# EAGLE design 4-layer (EAGLE 9.6.2)
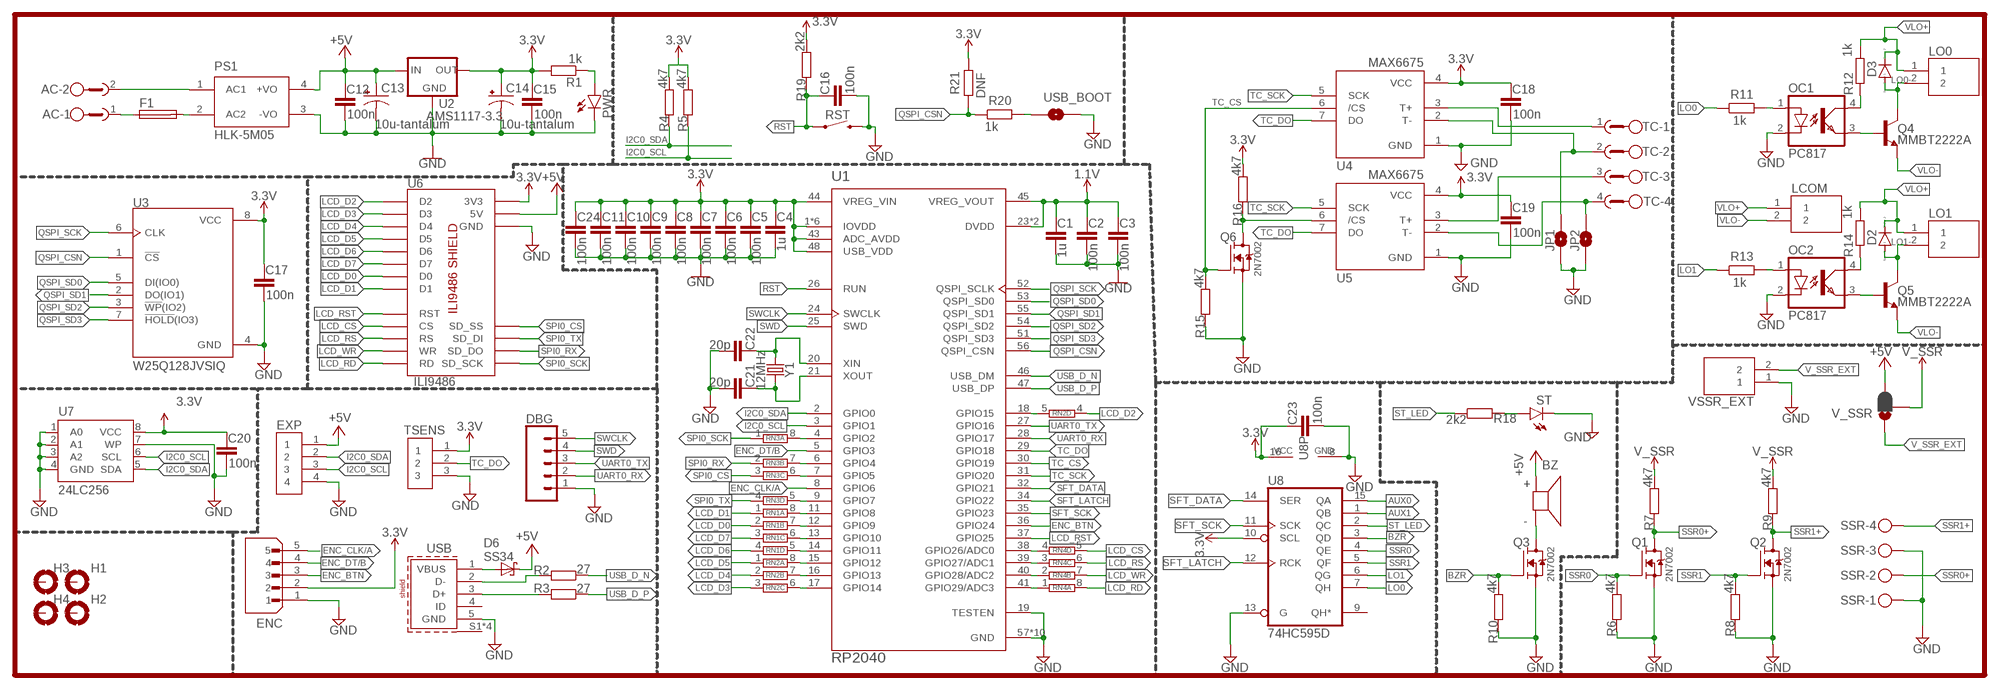
[diagram p0: schematic, sheet 1]

## Parts
AC  GMSTBA2  [GMSTBA2]
BZ  AI-1223-TWT-12V-R  [XDCR_AI-1223-TWT-12V-R]
C1  1u  C-EUC0603K  [C0603K]
C2  100n  C-EUC0603K  [C0603K]
C3  100n  C-EUC0603K  [C0603K]
C4  1u  C-EUC0603K  [C0603K]
C5  100n  C-EUC0603K  [C0603K]
C6  100n  C-EUC0603K  [C0603K]
C7  100n  C-EUC0603K  [C0603K]
C8  100n  C-EUC0603K  [C0603K]
C9  100n  C-EUC0603K  [C0603K]
C10  100n  C-EUC0603K  [C0603K]
C11  100n  C-EUC0603K  [C0603K]
C12  100n  C-EUC0603K  [C0603K]
C13  10u-tantalum  CPOL-USCT3528  [CT3528]
C14  10u-tantalum  CPOL-USCT3528  [CT3528]
C15  100n  C-EUC0603K  [C0603K]
C16  100n  C-EUC0603K  [C0603K]
C17  100n  C-EUC0603K  [C0603K]
C18  100n  C-EUC0603K  [C0603K]
C19  100n  C-EUC0603K  [C0603K]
C20  100n  C-EUC0603K  [C0603K]
C21  20p  C-EUC0603K  [C0603K]
C22  20p  C-EUC0603K  [C0603K]
C23  100n  C-EUC0603K  [C0603K]
C24  100n  C-EUC0603K  [C0603K]
D2  DIODE-DO-214AC  [DO-214AC]
D3  DIODE-DO-214AC  [DO-214AC]
D6  SS34  [DO214]
DBG  CONN_05NO_SILK  [1X05_NO_SILK]
ENC  B5B-XH-A(LF)(SN)  [JST_B5B-XH-A(LF)(SN)]
EXP  JST-XH-4P  B4B-XH-A(LF)(SN)  [JST_B4B-XH-A(LF)(SN)]
F1  FUSEBLANK_5X20MM  [FUSE_HOLDER_5X20MM]
H1  MOUNT-PAD-ROUND3.2  [3,2-PAD]
H2  MOUNT-PAD-ROUND3.2  [3,2-PAD]
H3  MOUNT-PAD-ROUND3.2  [3,2-PAD]
H4  MOUNT-PAD-ROUND3.2  [3,2-PAD]
JP1  JUMPER-SMT_2_NO_NO-SILK  [SMT-JUMPER_2_NO_NO-SILK]
JP2  JUMPER-SMT_2_NO_NO-SILK  [SMT-JUMPER_2_NO_NO-SILK]
LCOM  B2B-XH-A(LF)(SN)  [JST_B2B-XH-A(LF)(SN)]
LO0  B2B-XH-A(LF)(SN)  [JST_B2B-XH-A(LF)(SN)]
LO1  B2B-XH-A(LF)(SN)  [JST_B2B-XH-A(LF)(SN)]
OC1  PC817  [DIL04]
OC2  PC817  [DIL04]
PS1  HLK-5M05  [CONV_HLK-5M05]
PWR  LEDCHIP-LED0805  [CHIP-LED0805]
Q1  2N7002  [SOT95P240X111-3N]
Q2  2N7002  [SOT95P240X111-3N]
Q3  2N7002  [SOT95P240X111-3N]
Q4  MMBT2222A  TRANS_NPN-MMBT2222AL  [SOT23-3]
Q5  MMBT2222A  TRANS_NPN-MMBT2222AL  [SOT23-3]
Q6  2N7002  [SOT95P240X111-3N]
R1  1k  R-EU_R0603  [R0603]
R2  27  R-EU_R0603  [R0603]
R3  27  R-EU_R0603  [R0603]
R4  4k7  R-EU_R0603  [R0603]
R5  4k7  R-EU_R0603  [R0603]
R6  4k7  R-EU_R0603  [R0603]
R7  4k7  R-EU_R0603  [R0603]
R8  4k7  R-EU_R0603  [R0603]
R9  4k7  R-EU_R0603  [R0603]
R10  4k7  R-EU_R0603  [R0603]
R11  1k  R-EU_R0603  [R0603]
R12  1k  R-EU_R0603  [R0603]
R13  1k  R-EU_R0603  [R0603]
R14  1k  R-EU_R0603  [R0603]
R15  4k7  R-EU_R0603  [R0603]
R16  4k7  R-EU_R0603  [R0603]
R18  2k2  R-EU_R0603  [R0603]
R19  2k2  R-EU_R0603  [R0603]
R20  1k  R-EU_R0603  [R0603]
R21  DNF  R-EU_R0603  [R0603]
RN1  4R-N0402ARV341  [4X0402ARV341]
RN2  4R-N0402ARV341  [4X0402ARV341]
RN3  4R-N0402ARV341  [4X0402ARV341]
RN4  4R-N0402ARV341  [4X0402ARV341]
RST  MOMENTARY-SWITCH-SPST-SMD-6.0X3.5MM  [TACTILE_SWITCH_SMD_6.0X3.5MM]
SSR  MKDSN1,5/4-5,08  [MKDSN1,5/4-5,08]
ST  LEDCHIP-LED0805  [CHIP-LED0805]
TC  GMSTBA4  [GMSTBA4]
TSENS  B3B-XH-A(LF)(SN)  [JST_B3B-XH-A(LF)(SN)]
U1  RP2040  [QFN40P700X700X90-57N]
U2  AMS1117-3.3  AMS1117  [SOT89R]
U3  W25Q128JVSIQ  W25Q64BVSSIG  [SOIC127P790X216-8N]
U4  MAX6675  [SO08]
U5  MAX6675  [SO08]
U6  ILI9486  [ILI9486-SHIELD]
U7  24LC256  EEPROM-I2C256K  [SO08]
U8  74HC595D  [SO16]
USB  629105136821  [629105136821]
USB_BOOT  JUMPER-SMT_2_NO_SILK  [SMT-JUMPER_2_NO_SILK]
V_SSR  JUMPER-SMT_3_1-NC_PASTE_SILK  [SMT-JUMPER_3_1-NC_PASTE_SILK]
VSSR_EXT  B2B-XH-A(LF)(SN)  [JST_B2B-XH-A(LF)(SN)]
Y1  12MHz  CRYSTALPTH-HC49US  [HC49US]

## Nets
1.1V: C1.1 C2.1 C3.1 U1.23(DVDD) U1.45(VREG_VOUT) U1.50(DVDD)
3.3V: C4.1 C5.1 C6.1 C7.1 C8.1 C9.1 C10.1 C11.1 C14.+ C15.1 C17.1 C18.1 C19.1 C20.1 C23.1 C24.1 ENC.2 R1.2 R4.1 R5.1 R16.1 R19.1 R21.2 TSENS.1 U1.1(IOVDD) U1.10(IOVDD) U1.22(IOVDD) U1.33(IOVDD) U1.42(IOVDD) U1.43(ADC_AVDD) U1.44(VREG_VIN) U1.48(USB_VDD) U1.49(IOVDD) U2.3(OUT) U2.4(OUT) U3.8(VCC) U4.4(VCC) U5.4(VCC) U6.3V3 U7.8(VCC) U8.10(SCL) U8.16(VCC)
+5V: BZ.P(+) C12.1 C13.+ D6.C EXP.1 PS1.4(+VO) U2.1(IN) U6.5V V_SSR.3
AUX0: U8.15(QA)
AUX1: U8.1(QB)
BZR: Q3.1(G) R10.1 U8.3(QD)
ENC_BTN: ENC.3 U1.36(GPIO24)
ENC_CLK/A: ENC.5 U1.8(GPIO6)
ENC_DT/B: ENC.4 U1.5(GPIO3)
GND: C1.2 C2.2 C3.2 C4.2 C5.2 C6.2 C7.2 C8.2 C9.2 C10.2 C11.2 C12.2 C13.- C14.- C15.2 C16.2 C17.2 C18.2 C19.2 C20.2 C21.2 C22.2 C23.2 C24.2 DBG.1 ENC.1 EXP.4 JP1.1 JP2.1 OC1.2(C) OC2.2(C) PS1.3(-VO) PWR.C Q1.2(S) Q2.2(S) Q3.2(S) Q6.2(S) R6.2 R8.2 R10.2 R15.2 RST.2 SSR.1 SSR.3 ST.C TSENS.3 U1.19(TESTEN) U1.57(GND) U1.P$1(GND) U1.P$2(GND) U1.P$3(GND) U1.P$4(GND) U1.P$5(GND) U1.P$6(GND) U1.P$7(GND) U1.P$8(GND) U1.P$9(GND) U2.2(GND) U3.4(GND) U4.1(GND) U5.1(GND) U6.GND U6.GND1(GND) U6.GND2(GND) U7.1(A0) U7.2(A1) U7.3(A2) U7.4(GND) U7.7(WP) U8.8(GND) U8.13(G) USB.5(GND) USB_BOOT.2 VSSR_EXT.1
I2C0_SCL: EXP.3 R5.2 U1.3(GPIO1) U7.6(SCL)
I2C0_SDA: EXP.2 R4.2 U1.2(GPIO0) U7.5(SDA)
LCD_CS: RN4.5 U6.LCD_CS(CS)
LCD_D0: RN1.2 U6.LCD_D0(D0)
LCD_D1: RN1.1 U6.LCD_D1(D1)
LCD_D2: RN2.4 U6.LCD_D2(D2)
LCD_D3: RN2.3 U6.LCD_D3(D3)
LCD_D4: RN2.2 U6.LCD_D4(D4)
LCD_D5: RN2.1 U6.LCD_D5(D5)
LCD_D6: RN1.4 U6.LCD_D6(D6)
LCD_D7: RN1.3 U6.LCD_D7(D7)
LCD_RD: RN4.8 U6.LCD_RD(RD)
LCD_RS: RN4.6 U6.LCD_RS(RS)
LCD_RST: U1.37(GPIO25) U6.LCD_RST(RST)
LCD_WR: RN4.7 U6.LCD_WR(WR)
LO0: R11.1 U8.7(QH)
LO0-: D3.A LO0.2 Q4.3(C)
LO1: R13.1 U8.6(QG)
LO1-: D2.A LO1.2 Q5.3(C)
N$1: AC.1 F1.1
N$2: F1.2 PS1.2(AC2)
N$3: AC.2 PS1.1(AC1)
N$4: PWR.A R1.1
N$5: BZ.N(-) Q3.3(D)
N$6: R3.2 USB.3(D+)
N$7: R2.2 USB.2(D-)
N$8: OC1.1(A) R11.2
N$9: OC1.4(COL) R12.2
N$10: OC1.3(EMIT) Q4.1(B)
N$11: OC2.1(A) R13.2
N$12: OC2.4(COL) R14.2
N$13: OC2.3(EMIT) Q5.1(B)
N$14: Q6.3(D) R16.2 U5.6(/CS)
N$15: RN1.6 U1.13(GPIO10)
N$16: R20.2 USB_BOOT.1
N$17: RN1.7 U1.12(GPIO9)
N$18: R18.2 ST.A
N$19: RN1.8 U1.11(GPIO8)
N$20: RN1.5 U1.14(GPIO11)
N$21: RN2.8 U1.15(GPIO12)
N$22: RN2.7 U1.16(GPIO13)
N$23: RN2.6 U1.17(GPIO14)
N$24: D6.A USB.1(VBUS)
N$25: RN2.5 U1.18(GPIO15)
N$26: RN3.8 U1.4(GPIO2)
N$27: RN3.7 U1.6(GPIO4)
N$28: RN3.6 U1.7(GPIO5)
N$29: RN3.5 U1.9(GPIO7)
N$30: RN4.4 U1.38(GPIO26/ADC0)
N$31: RN4.3 U1.39(GPIO27/ADC1)
N$32: RN4.2 U1.40(GPIO28/ADC2)
N$33: RN4.1 U1.41(GPIO29/ADC3)
N$34: JP2.2 TC.4 U5.2(T-)
N$35: JP1.2 TC.2 U4.2(T-)
QSPI_CSN: R20.1 R21.1 U1.56(QSPI_CSN) U3.1(!CS)
QSPI_SCK: U1.52(QSPI_SCLK) U3.6(CLK)
QSPI_SD0: U1.53(QSPI_SD0) U3.5(DI(IO0))
QSPI_SD1: U1.55(QSPI_SD1) U3.2(DO(IO1))
QSPI_SD2: U1.54(QSPI_SD2) U3.3(!WP!(IO2))
QSPI_SD3: U1.51(QSPI_SD3) U3.7(!HOLD!(IO3))
RST: C16.1 R19.2 RST.1 U1.26(RUN)
SFT_DATA: U1.32(GPIO21) U8.14(SER)
SFT_LATCH: U1.34(GPIO22) U8.12(RCK)
SFT_SCK: U1.35(GPIO23) U8.11(SCK)
SPI0_CS: RN3.3 U6.SD_SS
SPI0_RX: RN3.2 U6.SD_DO
SPI0_SCK: RN3.1 U6.SD_SCK
SPI0_TX: RN3.4 U6.SD_DI
SSR0: Q1.1(G) R6.1 U8.4(QE)
SSR0+: Q1.3(D) R7.2 SSR.2
SSR1: Q2.1(G) R8.1 U8.5(QF)
SSR1+: Q2.3(D) R9.2 SSR.4
ST_LED: R18.1 U8.2(QC)
SWCLK: DBG.5 U1.24(SWCLK)
SWD: DBG.4 U1.25(SWD)
TC+0: TC.1 U4.3(T+)
TC+1: TC.3 U5.3(T+)
TC_CS: Q6.1(G) R15.1 U1.30(GPIO19) U4.6(/CS)
TC_DO: TSENS.2 U1.29(GPIO18) U4.7(DO) U5.7(DO)
TC_SCK: U1.31(GPIO20) U4.5(SCK) U5.5(SCK)
UART0_RX: DBG.2 U1.28(GPIO17)
UART0_TX: DBG.3 U1.27(GPIO16)
USB_D_N [USB_D]: R2.1 U1.46(USB_DM)
USB_D_P [USB_D]: R3.1 U1.47(USB_DP)
V_SSR: R7.1 R9.1 V_SSR.2
V_SSR_EXT: V_SSR.1 VSSR_EXT.2
VLO+: D2.C D3.C LCOM.1 LO0.1 LO1.1 R12.1 R14.1
VLO-: LCOM.2 Q4.2(E) Q5.2(E)
XIN: C22.1 U1.20(XIN) Y1.2
XOUT: C21.1 U1.21(XOUT) Y1.1
Unconnected: H1.B3,2(MOUNT) H2.B3,2(MOUNT) H3.B3,2(MOUNT) H4.B3,2(MOUNT) U8.9(QH*) USB.4(ID) USB.S1(SHIELD) USB.S2(SHIELD) USB.S3(SHIELD) USB.S4(SHIELD)

## Library data of the parts
AC = con-phoenix-762:GMSTBA2: PHOENIX; MF: FARNELL; MPN: 1757242; OC_FARNELL: 3705171; OC_NEWARK: 71C4161
BZ = hotberry:AI-1223-TWT-12V-R; MANUFACTURER: PUI Audio; MAXIMUM_PACKAGE_HEIGHT: 9.7 mm; PARTREV: F; STANDARD: IPC 7351B
C1-C12 C15-C24 = rcl:C-EU: CAPACITOR, European symbol; SPICEPREFIX: C
C13 C14 = rcl:CPOL-US: POLARIZED CAPACITOR, American symbol; SPICEPREFIX: C
D2 D3 = diode:DIODE-: DIODE
D6 = SS34:SS34: SS34 Schottky diode http://www.vishay.com/docs/88751/ss32.pdf Check prices <https://pricing.snapeda.com/parts/SS34/ON%20Semiconductor/view-part?ref=eda>; AVAILABILITY: In Stock; DESCRIPTION: Diode Schottky 40V 3A Surface Mount SMC (DO-214AB); MF: ON Semiconductor; MP: SS34; PACKAGE: SMC-2 ON Semiconductor; PRICE: None; PURCHASE-URL: https://pricing.snapeda.com/search/part/SS34/?ref=eda
DBG = SparkFun-Connectors:CONN_05: Multi connection point. Often used as Generic Header-pin footprint for 0.1 inch spaced/style header connections On any of the 0.1 inch spaced packages, you can populate with these: Break Away Headers - Straight <https://www.sparkfun.com/products/116> (PRT-00116) Break Away Male Headers - Right Angle <https://www.sparkfun.com/products/553> (PRT-00553) Female Headers <https://www.sparkfun.com/products/115> (PRT-00115) Break Away Headers - Machine Pin <https://www.sparkfun.com/products/117> (PRT-00117) Break Away Female Headers - Swiss Machine Pin <https://www.sparkfun.com/products/743> (PRT-00743) For SCREWTERMINALS and SPRING TERMINALS visit here: Screw Terimnals on SparkFun.com <https://www.sparkfun.com/search/results?term=Screw+Terminals> (5mm/3.5mm/2.54mm spacing) This device is also useful as a general connection point to wire up your design to another part of your project. Our various solder wires solder well into these plated through hole pads. Hook-Up Wire - Assortment (Stranded, 22 AWG) <https://www.sparkfun.com/products/11375> (PRT-11375) Hook-Up Wire - Assortment (Solid Core, 22 AWG) <https://www.sparkfun.com/products/11367> (PRT-11367) View the entire wire category on our website here <https://www.sparkfun.com/categories/141> Special notes: Molex polarized connector foot print use with SKU : PRT-08231 with associated crimp pins and housings. 1MM SMD Version SKU: PRT-10208
ENC = hotberry:B5B-XH-A(LF)(SN): Connector Header Through Hole 5 position 0.098in (2.50mm); MANUFACTURER: JST; MAXIMUM_PACKAGE_HEIGHT: 7.00mm; PARTREV: N/A; STANDARD: Manufacturer Recommendations
EXP = jst-xh:B4B-XH-A(LF)(SN): XH Series 4 Position 2.5 mm Pitch Through Hole Crimp Top Entry Shrouded Header; MANUFACTURER: JST Sales America Inc; PARTREV: NA; STANDARD: Manufacturer Recommendation
F1 = fuse:FUSE: Fuse; OC_FARNELL: unknown; OC_NEWARK: unknown
H1-H4 = holes:MOUNT-PAD-ROUND: MOUNTING PAD, round
JP1 JP2 USB_BOOT = SparkFun-Jumpers:JUMPER-SMT_2_NO: Normally open jumper This jumper has two pads in close proximity to each other. Apply solder to close the connection. Round pads are easier to solder for beginners, but are a lot larger. SparkFun Product that uses the round pads: SparkFun EL Sequencer <https://www.sparkfun.com/products/12781>
LCOM LO0 LO1 VSSR_EXT = hotberry:B2B-XH-A(LF)(SN): Connector Header Through Hole 2 position 0.098" (2.50mm) Check prices <https://pricing.snapeda.com/parts/B2B-XH-A%28LF%29%28SN%29/JST%20Sales/view-part?ref=eda>; AVAILABILITY: In Stock; DESCRIPTION: Connector Header Through Hole 2 position 0.098 (2.50mm); MF: JST Sales; MP: B2B-XH-A(LF)(SN); PACKAGE: None; PRICE: None
OC1 OC2 = optocoupler:PC817: SHARP OPTO COUPLER; MPN: PC817X4J000F; OC_FARNELL: 9707727; OC_NEWARK: 97K7059
PS1 = hotberry:HLK-5M05: AC DC 220V to 5V 5W 5Watt Isolated Switching Step-Down Power Supply Module Converter; MANUFACTURER: HI-LINK; PARTREV: N/A; STANDARD: Manufacturer Recommendations
PWR ST = led:LED: LED OSRAM: - CHIPLED LG R971, LG N971, LY N971, LG Q971, LY Q971, LO R971, LY R971 LH N974, LH R974 LS Q976, LO Q976, LY Q976 LO Q996 - Hyper CHIPLED LW Q18S LB Q993, LB Q99A, LB R99A - SideLED LS A670, LO A670, LY A670, LG A670, LP A670 LB A673, LV A673, LT A673, LW A673 LH A674 LY A675 LS A676, LA A676, LO A676, LY A676, LW A676 LS A679, LY A679, LG A679 - Hyper Micro SIDELED® LS Y876, LA Y876, LO Y876, LY Y876 LT Y87S - SmartLED LW L88C, LW L88S LB L89C, LB L89S, LG L890 LS L89K, LO L89K, LY L89K LS L896, LA L896, LO L896, LY L896 - TOPLED LS T670, LO T670, LY T670, LG T670, LP T670 LSG T670, LSP T670, LSY T670, LOP T670, LYG T670 LG T671, LOG T671, LSG T671 LB T673, LV T673, LT T673, LW T673 LH T674 LS T676, LA T676, LO T676, LY T676, LB T676, LH T676, LSB T676, LW T676 LB T67C, LV T67C, LT T67C, LS T67K, LO T67K, LY T67K, LW E67C LS E67B, LA E67B, LO E67B, LY E67B, LB E67C, LV E67C, LT E67C LW T67C LS T679, LY T679, LG T679 LS T770, LO T770, LY T770, LG T770, LP T770 LB T773, LV T773, LT T773, LW T773 LH T774 LS E675, LA E675, LY E675, LS T675 LS T776, LA T776, LO T776, LY T776, LB T776 LHGB T686 LT T68C, LB T68C - Hyper Mini TOPLED® LB M676 - Mini TOPLED Santana® LG M470 LS M47K, LO M47K, LY M47K Source: http://www.osram.convergy.de LUXEON: - LUMILED® LXK2-PW12-R00, LXK2-PW12-S00, LXK2-PW14-U00, LXK2-PW14-V00 LXK2-PM12-R00, LXK2-PM12-S00, LXK2-PM14-U00 LXK2-PE12-Q00, LXK2-PE12-R00, LXK2-PE12-S00, LXK2-PE14-T00, LXK2-PE14-U00 LXK2-PB12-K00, LXK2-PB12-L00, LXK2-PB12-M00, LXK2-PB14-N00, LXK2-PB14-P00, LXK2-PB14-Q00 LXK2-PR12-L00, LXK2-PR12-M00, LXK2-PR14-Q00, LXK2-PR14-R00 LXK2-PD12-Q00, LXK2-PD12-R00, LXK2-PD12-S00 LXK2-PH12-R00, LXK2-PH12-S00 LXK2-PL12-P00, LXK2-PL12-Q00, LXK2-PL12-R00 Source: www.luxeon.com KINGBRIGHT: KA-3528ASYC Source: www.kingbright.com
Q1-Q3 Q6 = hotberry:2N7002: N-Channel 60V 280mA (Ta) 350mW (Ta) Surface Mount SOT-23-3 (TO-236) Check availability <https://pricing.snapeda.com/parts/2N7002/ON%20Semiconductor/view-part?ref=eda>; AVAILABILITY: In Stock; DESCRIPTION: N-Channel 60V 280mA (Ta) 350mW (Ta) Surface Mount SOT-23-3 (TO-236); MF: ON Semiconductor; MP: 2N7002; PACKAGE: SOT-23-3 ON Semiconductor; PRICE: None; PURCHASE-URL: https://pricing.snapeda.com/search/part/2N7002/?ref=eda
Q4 Q5 = SparkFun-DiscreteSemi:TRANS_NPN: NPN transistor Current controlled devices typically used to amplify current or used as a switch. BC547 - COM-08928 <http://www.sparkfun.com/products/8928> (TO-92 45V 100mA) (1.Collector 2.Base 3.Emitter) 2N3904 - COM-00521 <http://www.sparkfun.com/products/521> (TO-92 40V 200mA) (1.Emitter 2.Base 3.Collector) P2N2222A - COM-12852 <http://www.sparkfun.com/products/12852> (TO-92 40V 600mA) (1.Collector 2.Base 3.Emitter); PROD_ID: TRANS-08049; VALUE: 600mA/40V
R1-R16 R18-R21 = rcl:R-EU_: RESISTOR, European symbol; SPICEPREFIX: R
RN1-RN4 = resistor-dil:4R-N: Array Chip Resistor Source: RS Component / Phycomp; OC_FARNELL: unknown; OC_NEWARK: unknown
RST = SparkFun-Switches:MOMENTARY-SWITCH-SPST: Momentary Switch (Pushbutton) - SPST Normally-open (NO) SPST momentary switches (buttons, pushbuttons). Variants PTH-12MM - 12mm square, through-hole Momentary Pushbutton Switch - 12mm Square <https://www.sparkfun.com/products/9190> (COM-09190) PTH-6.0MM, PTH-6.0MM-KIT - 6.0mm square, through-hole Mini Pushbutton Switch <https://www.sparkfun.com/products/97> (COM-00097) KIT package intended for soldering kit's - only one side of pads' copper is exposed. PTH-RIGHT-ANGLE-KIT - Right-angle, through-hole Right Angle Tactile Button <https://www.sparkfun.com/products/10791> - Used on SparkFun BigTime Watch Kit <https://www.sparkfun.com/products/11734> SMD-12MM - 12mm square, surface-mount Tactile Button - SMD (12mm) <https://www.sparkfun.com/products/12993> (COM-12993) Used on SparkFun PicoBoard <https://www.sparkfun.com/products/11888> SMD-4.5MM - 4.5mm Square Trackball Switch Used on SparkFun Blackberry Trackballer Breakout <https://www.sparkfun.com/products/13169> SMD-4.6MMX2.8MM - 4.60mm x 2.80mm, surface mount Used on SparkFun Pro Micro - RP2040 <https://www.sparkfun.com/products/17717> SMD-5.2MM, SMD-5.2-REDUNDANT - 5.2mm square, surface-mount Mini Pushbutton Switch - SMD <https://www.sparkfun.com/products/8720> (COM-08720) Used on Arduino Pro Mini <https://www.sparkfun.com/products/11114> REDUNDANT package connects both switch circuits together SMD-6.0X3.5MM - 6.0 x 3.5mm, surface mount Momentary Reset Switch SMD <https://www.sparkfun.com/products/8229> (COM-08229) SMD-6.2MM-TALL - 6.2mm square, surface mount Tactile Button - SMD (6mm) <https://www.sparkfun.com/products/12992> Used on SparkFun Digital Sandbox <https://www.sparkfun.com/products/12651> SMD-RIGHT-ANGLE - Right-angle, surface mount Used on SparkFun Block for Intel® Edison - Arduino <https://www.sparkfun.com/products/13036>; PROD_ID: SWCH-14278; SF_SKU: COM-08229
SSR = con-phoenix-508:MKDSN1,5/4-5,08: MKDSN 1,5/ 4-5,08 Printklemme Nennstrom: 13,5 A Nennspannung: 250 V Rastermaß: 5,08 mm Polzahl: 4 Anschlussart: Schraubanschluss Montage: Löten Anschlussrichtung Leiter/Platine: 0 ° Artikelnummer: 1729144 Source: http://eshop.phoenixcontact.com .. 1729144.pdf
TC = con-phoenix-762:GMSTBA4: PHOENIX; MF: FARNELL; MPN: 1757268; OC_FARNELL: 3705195; OC_NEWARK: 71C4163
TSENS = jst-xh:B3B-XH-A(LF)(SN): Connector Header Through Hole 3 position 0.098" (2.50mm) Check prices <https://pricing.snapeda.com/parts/B3B-XH-A%28LF%29%28SN%29/JST%20Sales/view-part?ref=eda>; AVAILABILITY: In Stock; DESCRIPTION: Connector Header Through Hole 3 position 0.098 (2.50mm); MF: JST Sales; MP: B3B-XH-A(LF)(SN); PACKAGE: None; PRICE: None
U1 = hotberry:RP2040; MANUFACTURER: Raspberry Pi; MAXIMUM_PACKAGE_HEIGHT: 0.9 mm; PARTREV: 1.6.1; STANDARD: IPC 7351B
U2 = v-reg:AMS1117
U3 = hotberry:W25Q64BVSSIG: IC FLASH 64MBIT 80MHZ 8SOIC; AVAILABILITY: Unavailable; DESCRIPTION: 64m Serail Flash; MF: Winbond Electronics; MP: W25Q64BVSSIG; PACKAGE: SOIC-8 Winbond; PRICE: None; SNAPEDA_PACKAGE_ID: 5766
U4 U5 = adafruit:MAX6675
U6 = hotberry:ILI9486
U7 = SparkFun-IC-Memory:EEPROM-I2C: I2C EEPROMs, 24LC256 and others 24LC256 Series 256 kb I2C 2 Wire (32 k x 8 Bit) 2.5 V Serial EEPROM SMD - SOIC-8 Datasheet SparkFun Products SparkFun UDB5 - PIC UAV Development Board <https://www.sparkfun.com/products/11703> (GPS-11703); PROD_ID: IC-09714
U8 = 74xx-eu:74*595: 8-bit SHIFT REGISTER, output latch
USB = Wurth_Connectors_WR-USB:629105136821: WR-COM Micro USB 2.0 SMT Type B Horizontal 5 Contacts Kind Properties Durability:10 000 Mating cycles Quality Class:10 000 Mating cycles Connector Type:Micro USB Gender:Receptacle Type:Horizontal General Information Operating Temperature:-40up to +105 °C Compliance:RoHS Electrical Properties IR 1:1A Working Voltage:30V (AC) Withstanding Voltage:100V (AC) Contact Resistance:30 mΩ Material Properties Insulator Material:LCP Insulator Flammability Rating:UL94 V-0 Color:Black Contact Material:Copper Alloy Contact Plating: Gold Contact Type:Stamped Shielding Material:Stainless Steel Shielding Plating:Nickel <https://www.we-online.com/catalog/media/o32999v209%20Family_WR-COM_629105136821.jpg> Details see: https://www.we-online.com/catalog/en/COM_MICRO_SMT_TYPE_B_HORIZONTAL/ Updated by Yingchun, Shan 2020-01-16 2020 (C) Würth Elektronik; APPLICATION: Micro USB 2.0; DATASHEET-URL: https://www.we-online.com/catalog/datasheet/629105136821.pdf; GERDER: Receptacle; INTERFACE-TYPE: Type B; IR1: 1.0A; MOUNT: SMT; PACKAGING: Tape and Reel; PART-NUMBER: 629105136821; PINS: 5; TYPE: Horizontal; WORKING-VOLTAGE: 30V(AC)
V_SSR = SparkFun-Jumpers:JUMPER-SMT_3_1-NC_PASTE: Normally closed solder jumper (1 of 2 connections) This jumper has an aperture in the stencil to allow solder paste to bridge one of the two connections. One connection is normally closed (NC), while the other is normally open (NO). Wick off the solder to open the connection. Reapply solder to reclose the connection. Apply solder to the other side instead to change the current path.
Y1 = SparkFun-Clocks:CRYSTAL: Crystals (Generic) These are passive quartz crystals, which can be used as a clock source for a microcontroller. Crystal's are two-terminal devices. They require external "load" capacitors to generate an oscillating signal.

## Net classes
1 USB_D: width 0.152 mm, clearance 0.152 mm

## Board
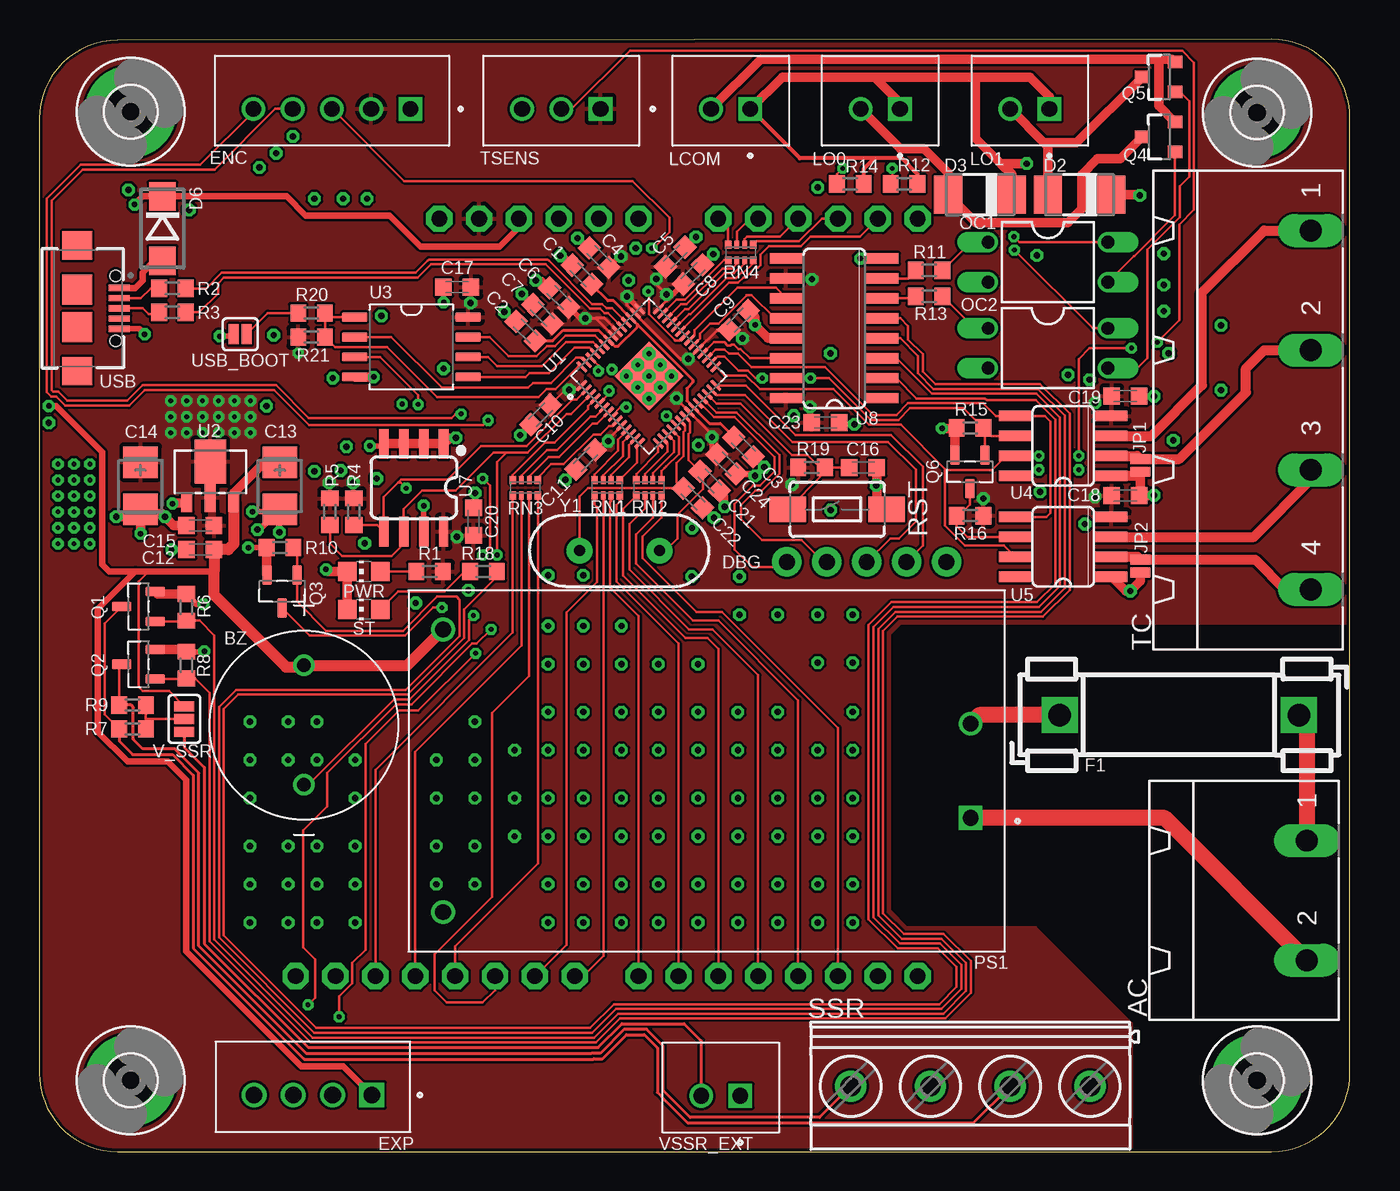
[diagram p1: board, top side]
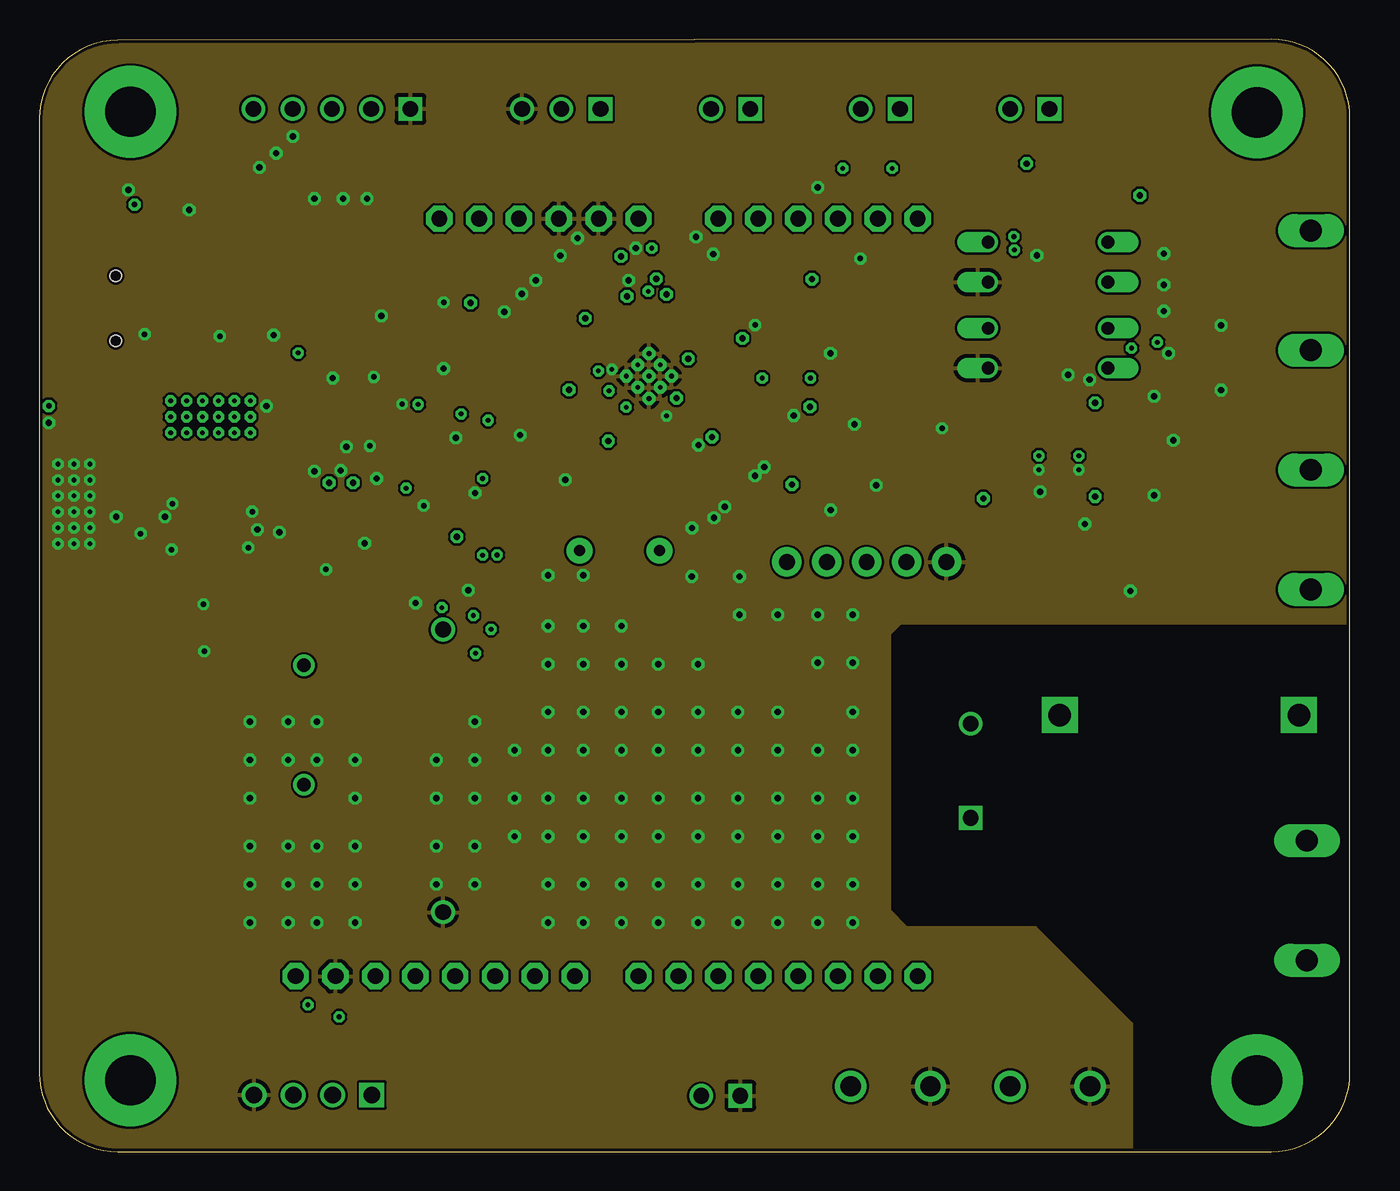
[diagram p2: board, inner layer Route2]
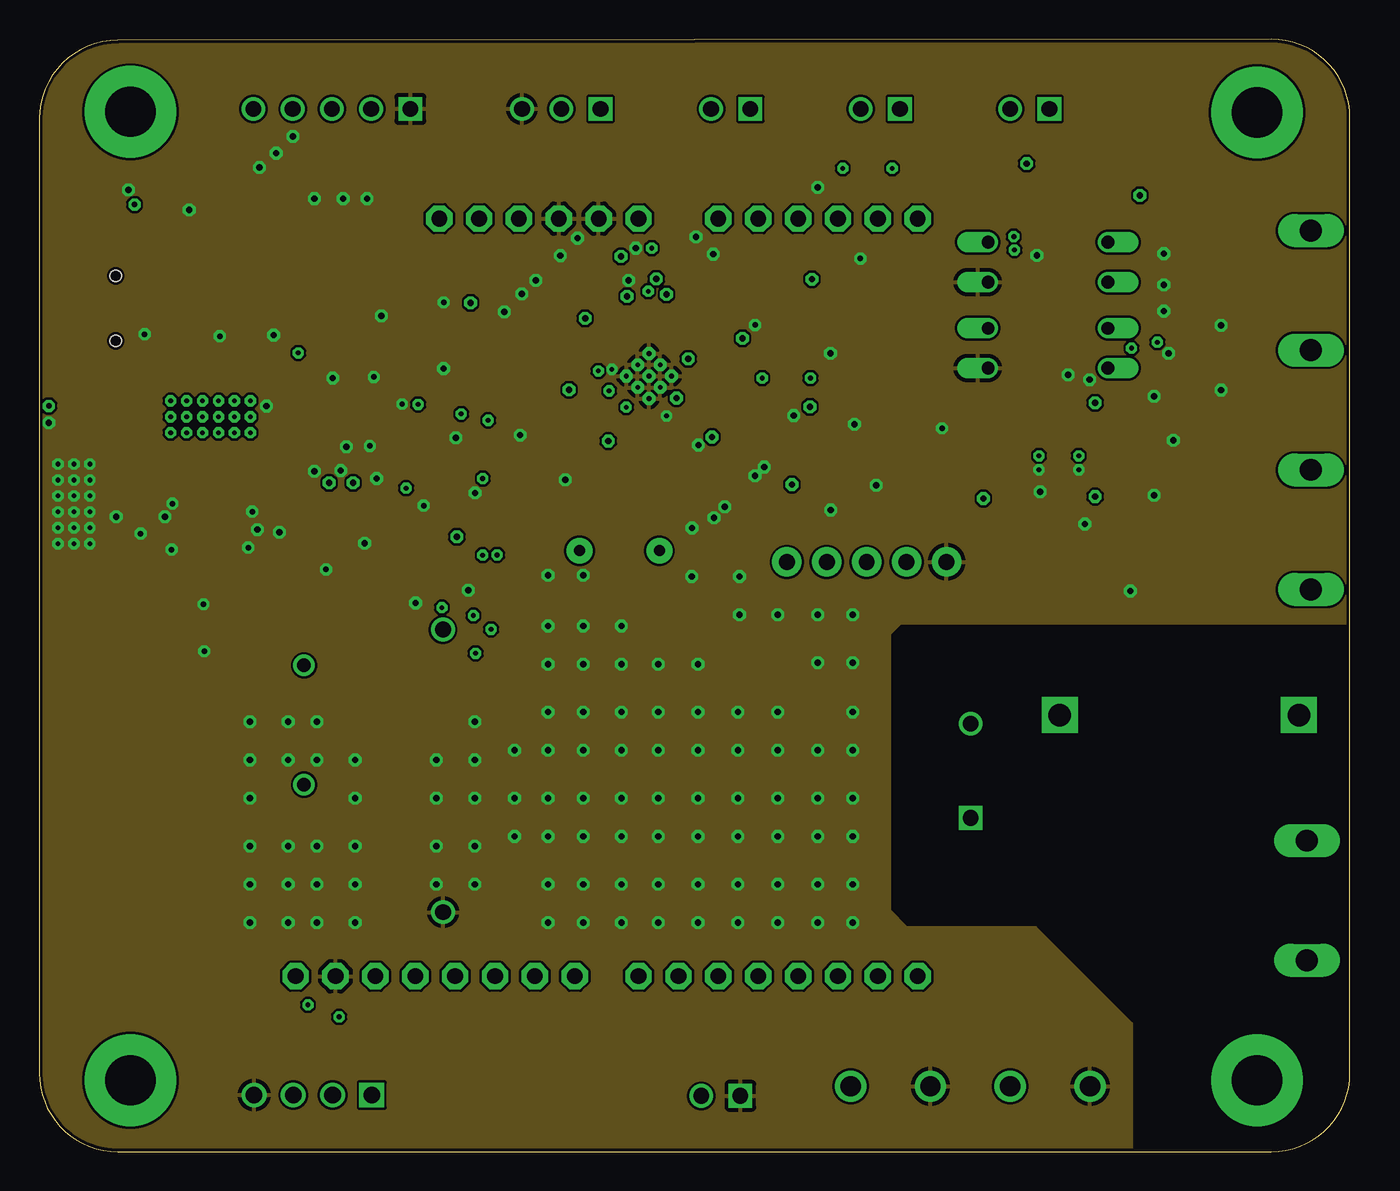
[diagram p3: board, inner layer Route15]
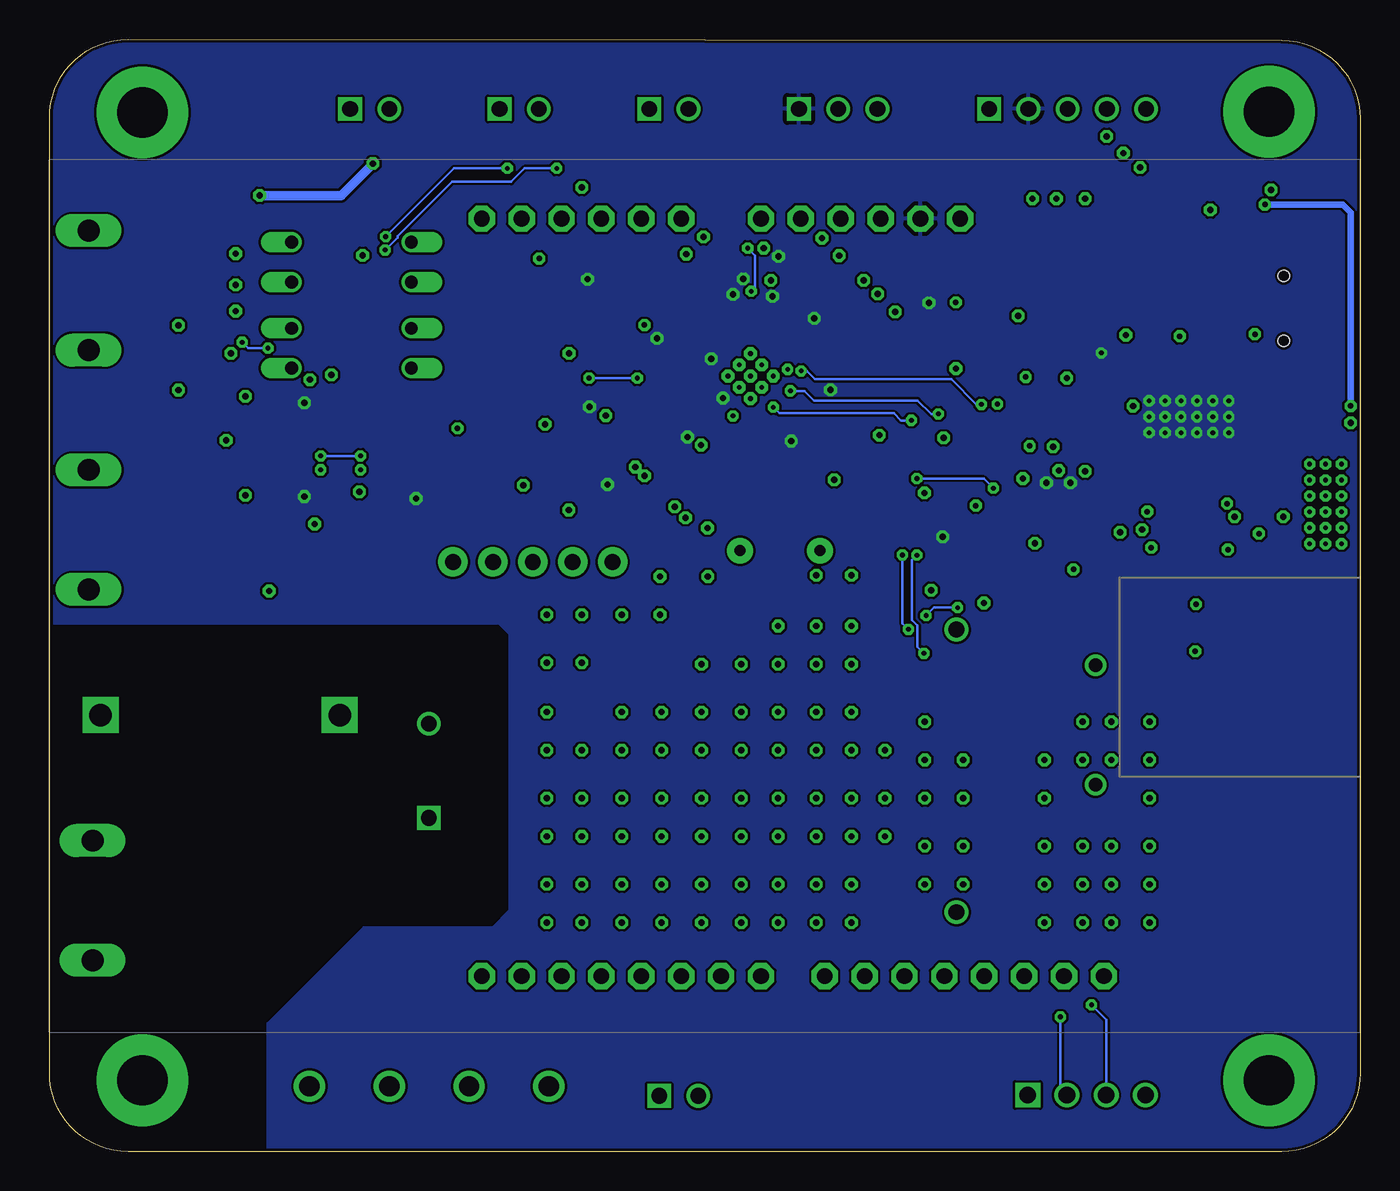
[diagram p4: board, bottom side, seen from below]

Size 83.49 x 70.86 mm. Coordinates in mm from the lower left corner, seen from the top.
Outline: 0,65.8 0,5 arc90 5,0 78.49,0 arc90 83.49,5 83.49,65.86 arc90 78.49,70.86 5,70.8 arc90 0,65.8
Copper layers (1+2*15+16): Top 0.035mm / dielectric 1.5mm / Route2 0.035mm / dielectric 0.15mm / Route15 0.035mm / dielectric 0.2mm / Bottom 0.035mm
Design rules "nextpcb *": minimum track width 6mil, minimum drill 0.3mm, track to track 6mil, track to pad 6mil, pad to pad 6mil, via to via 6mil, smd to smd 6mil, copper to edge 8mil, drill to drill 8mil, minimum pad ring 10mil, minimum via ring 8mil, stop-mask expansion 4mil, vias tented up to drill 25mil, thermal gap 10mil

### Footprints (pad centres in the part's own frame; a part is rotated, then mirrored left to right if it is on the bottom)
GMSTBA2 = drill 1.397 long: 1 -3.81,5.08; 2 3.81,5.08
XDCR_AI-1223-TWT-12V-R = drill 0.85: N 0,-3.8; P 0,3.8
C0603K = smd 1.05 x 1.08: 1 -0.875,0; 2 0.875,0
CT3528 = smd 2 x 2.2: + -1.5,0; - 1.5,0
DO-214AC = smd 1.8 x 2.4: A 2.025,0; C -2.025,0
DO214 = smd 1.8 x 1.7: A 2.05,0; C -2.05,0
1X05_NO_SILK = drill 1.016 pad 1.88: 1 0,0; 2 2.54,0; 3 5.08,0; 4 7.62,0; 5 10.16,0
JST_B5B-XH-A(LF)(SN) = drill 1 square: 1 -5,0 | drill 1: 2 -2.5,0; 3 0,0; 4 2.5,0; 5 5,0
JST_B4B-XH-A(LF)(SN) = drill 1.06 square: 1 0,0 | drill 1.06: 2 2.5,0; 3 5,0; 4 7.5,0
FUSE_HOLDER_5X20MM = drill 1.422 pad 2.286 square: 1 0,0; 2 15.24,0
3,2-PAD = drill 3.2 pad 5.842: B3,2 0,0
SMT-JUMPER_2_NO_NO-SILK = smd 0.635 x 1.27: 1 -0.406,0; 2 0.406,0
JST_B2B-XH-A(LF)(SN) = drill 1 square: 1 1.25,0 | drill 1: 2 -1.25,0
DIL04 = drill 0.813 offset: 1 -1.27,-3.81; 2 1.27,-3.81; 3 1.27,3.81; 4 -1.27,3.81
CONV_HLK-5M05 = drill 1 pad 1.5 square: 1 -16.8,3 | drill 1 pad 1.5: 2 -16.8,-3; 3 16.8,9; 4 16.8,-9
CHIP-LED0805 = smd 1.2 x 1.2: A 0,-1.05; C 0,1.05
SOT95P240X111-3N = smd 1.23 x 0.6: 1 -1.06,0.95; 2 -1.06,-0.95; 3 1.06,0
SOT23-3 = smd 0.8 x 0.9: 1 -0.95,-1; 2 0.95,-1; 3 0,1.1
R0603 = smd 1 x 1.1: 1 -0.85,0; 2 0.85,0
4X0402ARV341 = smd 0.4 x 0.5: 1 -0.8,-0.5; 4 0.8,-0.5; 5 0.8,0.5; 8 -0.8,0.5 | smd 0.3 x 0.5: 2 -0.25,-0.5; 3 0.25,-0.5; 6 0.25,0.5; 7 -0.25,0.5
TACTILE_SWITCH_SMD_6.0X3.5MM = smd 2.3 x 1.6: 1 -3.15,0; 2 3.15,0
MKDSN1,5/4-5,08 = drill 1.3 pad 2: 1 -7.641,0.025; 2 -2.561,0.025; 3 2.519,0.025; 4 7.599,0.025
GMSTBA4 = drill 1.397 long: 1 -11.43,5.08; 2 -3.81,5.08; 3 3.81,5.08; 4 11.43,5.08
JST_B3B-XH-A(LF)(SN) = drill 1 square: 1 2.5,0 | drill 1: 2 0,0; 3 -2.5,0
QFN40P700X700X90-57N = smd 0.84 x 0.2: 1 -3.435,2.6; 2 -3.435,2.2; 3 -3.435,1.8; 4 -3.435,1.4; 5 -3.435,1; 6 -3.435,0.6; 7 -3.435,0.2; 8 -3.435,-0.2; 9 -3.435,-0.6; 10 -3.435,-1; 11 -3.435,-1.4; 12 -3.435,-1.8; 13 -3.435,-2.2; 14 -3.435,-2.6; 29 3.435,-2.6; 30 3.435,-2.2; 31 3.435,-1.8; 32 3.435,-1.4; 33 3.435,-1; 34 3.435,-0.6; 35 3.435,-0.2; 36 3.435,0.2; 37 3.435,0.6; 38 3.435,1; 39 3.435,1.4; 40 3.435,1.8; 41 3.435,2.2; 42 3.435,2.6 | smd 0.2 x 0.84: 15 -2.6,-3.435; 16 -2.2,-3.435; 17 -1.8,-3.435; 18 -1.4,-3.435; 19 -1,-3.435; 20 -0.6,-3.435; 21 -0.2,-3.435; 22 0.2,-3.435; 23 0.6,-3.435; 24 1,-3.435; 25 1.4,-3.435; 26 1.8,-3.435; 27 2.2,-3.435; 28 2.6,-3.435; 43 2.6,3.435; 44 2.2,3.435; 45 1.8,3.435; 46 1.4,3.435; 47 1,3.435; 48 0.6,3.435; 49 0.2,3.435; 50 -0.2,3.435; 51 -0.6,3.435; 52 -1,3.435; 53 -1.4,3.435; 54 -1.8,3.435; 55 -2.2,3.435; 56 -2.6,3.435 | smd 3.1 x 3.1: 57 0,0 | drill 0.3 octagon: P$1 -1.016,1.016; P$2 0,1.016; P$3 1.016,1.016; P$4 0,0; P$5 -1.016,0; P$6 1.016,0; P$7 -1.016,-1.016; P$8 0,-1.016; P$9 1.016,-1.016
SOT89R = smd 0.7 x 1.1: 1 1.5,-1.75; 2 -1.5,-1.75 | smd 0.7 x 1.8: 3 0,-1.4 | smd 2 x 2.8: 4 0,0.9
SOIC127P790X216-8N = smd 1.61 x 0.58: 1 -3.605,1.905; 2 -3.605,0.635; 3 -3.605,-0.635; 4 -3.605,-1.905; 5 3.605,-1.905; 6 3.605,-0.635; 7 3.605,0.635; 8 3.605,1.905
SO08 = smd 0.66 x 2.032: 1 -1.905,-3.073; 2 -0.635,-3.073; 3 0.635,-3.073; 4 1.905,-3.073; 5 1.905,3.073; 6 0.635,3.073; 7 -0.635,3.073; 8 -1.905,3.073
ILI9486-SHIELD = drill 1 pad 1.676 octagon: 3V3 2.54,-26.67; 5V 5.08,-26.67; GND -6.604,21.59; GND1 10.16,-26.67; GND2 7.62,-26.67; LCD_CS 25.4,-26.67; LCD_D0 8.636,21.59; LCD_D1 6.096,21.59; LCD_D2 25.4,21.59; LCD_D3 22.86,21.59; LCD_D4 20.32,21.59; LCD_D5 17.78,21.59; LCD_D6 15.24,21.59; LCD_D7 12.7,21.59; LCD_RD 17.78,-26.67; LCD_RS 22.86,-26.67; LCD_RST 27.94,-26.67; LCD_WR 20.32,-26.67; NC0 30.48,21.59; NC1 27.94,21.59; NC2 -9.144,21.59; NC3 30.48,-26.67; NC4 12.7,-26.67; NC5 0,-26.67; SD_DI 1.016,21.59; SD_DO -1.524,21.59; SD_SCK -4.064,21.59; SD_SS 3.556,21.59
SO08' = smd 0.61 x 1.905: 1 -1.905,-2.8; 2 -0.635,-2.8; 3 0.635,-2.8; 4 1.905,-2.8 | smd 0.6 x 1.905: 5 1.905,2.8; 6 0.635,2.8; 7 -0.635,2.8; 8 -1.905,2.8
SO16 = smd 0.66 x 2.032: 1 -4.445,-3.073; 2 -3.175,-3.073; 3 -1.905,-3.073; 4 -0.635,-3.073; 5 0.635,-3.073; 6 1.905,-3.073; 7 3.175,-3.073; 8 4.445,-3.073; 9 4.445,3.073; 10 3.175,3.073; 11 1.905,3.073; 12 0.635,3.073; 13 -0.635,3.073; 14 -1.905,3.073; 15 -3.175,3.073; 16 -4.445,3.073
629105136821 = smd 0.4 x 1.35: 1 -1.3,2.325; 2 -0.65,2.325; 3 0,2.325; 4 0.65,2.325; 5 1.3,2.325 | smd 1.8 x 1.9: S1 -4,-0.35; S4 4,-0.35 | smd 1.9 x 1.9: S2 -1.2,-0.35; S3 1.2,-0.35 | hole 0.7: -2.075,2.1; 2.075,2.1
SMT-JUMPER_2_NO_SILK = smd 0.635 x 1.27: 1 -0.406,0; 2 0.406,0
SMT-JUMPER_3_1-NC_PASTE_SILK = smd 0.635 x 1.27: 1 -0.813,0; 2 0,0; 3 0.813,0
HC49US = drill 0.7 pad 1.651: 1 -2.54,0; 2 2.54,0

### Placement (x,y rotation side)
AC  75.67,16 270 top
BZ  16.87,27.18 0 top
C1  34.57,55.85 135 top
C2  30.99,52.27 135 top
C3  44.86,44.88 315 top
C4  35.66,56.95 135 top
C5  40.51,57 45 top
C6  33.12,54.41 135 top
C7  32.05,53.34 135 top
C8  41.63,55.88 45 top
C9  44.55,52.96 45 top
C10  31.93,46.94 225 top
C11  34.8,44.09 225 top
C12  10.26,38.35 180 top
C13  15.34,42.42 270 top
C14  6.45,42.42 270 top
C15  10.26,39.88 180 top
C16  52.48,43.59 0 top
C17  26.62,55.07 180 top
C18  69.19,41.78 0 top
C19  69.19,48.13 0 top
C20  27.66,40.13 90 top
C21  42.71,42.71 315 top
C22  41.63,41.63 315 top
C23  50.09,46.43 0 top
C24  43.78,43.8 315 top
D2  66.27,60.96 180 top
D3  59.92,60.96 180 top
D6  7.85,58.8 270 top
DBG  57.79,37.57 180 top
ENC  18.64,66.42 180 top
EXP  21.18,3.61 180 top
F1  80.24,27.81 180 top
H1  5.82,66.24 0 top
H2  77.57,66.19 0 top
H3  5.82,4.55 0 top
H4  77.57,4.55 0 top
JP1  70.13,43.71 90 top
JP2  70.13,37.31 90 top
LCOM  44.04,66.42 0 top
LO0  53.57,66.42 0 top
LO1  63.09,66.42 0 top
OC1  64.25,56.67 270 top
OC2  64.25,51.18 270 top
PS1  42.52,24.26 180 top
PWR  20.68,36.96 90 top
Q1  6.32,34.73 180 top
Q2  6.32,31.05 180 top
Q3  15.47,35.69 270 top
Q4  71.35,64.64 90 top
Q5  71.35,68.45 90 top
Q6  59.28,43.31 270 top
R1  24.87,36.96 0 top
R2  8.48,54.99 180 top
R3  8.48,53.47 180 top
R4  20.04,40.77 270 top
R5  18.52,40.77 270 top
R6  9.37,34.67 90 top
R7  5.94,26.92 180 top
R8  9.37,30.99 90 top
R9  5.94,28.45 180 top
R10  15.34,38.48 180 top
R11  56.68,56.13 0 top
R12  55.09,61.65 180 top
R13  56.68,54.48 0 top
R14  51.66,61.65 180 top
R15  59.28,46.1 180 top
R16  59.28,40.51 180 top
R18  28.3,36.96 180 top
R19  49.2,43.59 0 top
R20  17.35,53.42 180 top
R21  17.35,51.89 180 top
RN1  36.17,42.29 0 top
RN2  38.84,42.29 0 top
RN3  30.96,42.29 0 top
RN4  44.68,57.28 0 top
RST  50.83,40.92 0 top
SSR  59.28,4.19 180 top
ST  20.68,34.54 90 top
TC  75.92,47.24 270 top
TSENS  33.25,66.42 0 top
U1  38.84,49.4 45 top
U2  10.9,43.05 0 top
U3  23.7,51.26 0 top
U4  65.23,44.96 90 top
U5  65.23,38.53 90 top
U6  25.48,32.77 180 bottom
U7  24LC256  [SO08']  23.85,42.29 180 top
U8  50.65,52.45 90 top
USB  2.77,53.72 270 top
USB_BOOT  12.8,52.07 180 top
V_SSR  9.25,27.56 90 top
VSSR_EXT  43.41,3.56 0 top
Y1  36.96,38.28 180 top

### Tracks (layer width: path | path; a pad name or v marks a point on that pad's centre or on a via)
1.1V
  Top 0.2: C1.1 36.23,54.2 36.58,54.2 37.67,53.1 U1.45 38.1,52.69 | C2.1 32.71,51.65 33.38,52.32 35.63,52.32 U1.50 36.66,51.3 36.87,51.3 38.1,52.53 38.1,52.69 | 38.1,52.69 38.12,52.69 41.66,49.15 41.66,49.02 41.25,48.62 41.25,47.84 U1.23 42.71,46.38 43.38,46.38 44.24,45.53 C3.1
3.3V  (via drill 0.3, 0.4)
  Top 0.152: C10.1 33.52,48.54 v33.75,48.54
  Top 0.2: v34.77,53.09 35.44,53.09 | 35.44,53.09 U1.49 | 35.44,53.09 36,53.09 U1.48 | v37.44,54.48 37.44,53.91 U1.44 40.86,50.49 v41.34,50.49 | U1.10 36.25,45.4 v36.25,45.27 | U1.1 34.29,48.54 v33.75,48.54 | U1.22 42.85,45.67 v42.85,45.52 | U1.33 43.19,52.34 C9.1 | U1.42 39.96,54.2 v39.96,54.61 39.3,55.27 v39.3,55.6 39.3,55.78 C5.1
  Top 0.203: U1.33 v41.34,50.49 | U1.22 40.59,47.93 v40.59,48.01 | C11.1 35.97,45.27 v36.25,45.27
  Top 0.305: C6.1 34.44,53.09 v34.77,53.09 | C4.1 36.98,57.02 v37.06,57.02 | U1.43 v37.44,54.48 | C8.1 40.36,54.61 v39.96,54.61 | C9.1 44.26,52.34 v44.79,51.8 | C24.1 42.85,44.73 v42.85,45.52
  other vias: 27.48,54.07 49.09,47.45 47.95,42.49 60.14,41.6 67.25,41.73 67.25,47.7 26.6,39.17 18.47,42.6 19.99,42.6 11.42,45.8 10.4,45.8 9.38,45.8 8.37,45.8 12.43,45.8 13.45,45.8 8.37,46.81 9.38,46.81 9.38,47.83 8.37,47.83 10.4,47.83 10.4,46.81 11.42,46.81 11.42,47.83 12.43,46.81 12.43,47.83 13.45,46.81 13.45,47.83 16.5,50.88 49.22,55.57
  pour Top: 0,70.87 83.41,70.87 83.41,33.66 54.89,33.66 54.18,32.94 54.18,15.39 55.27,14.3 63.47,14.3 69.6,8.18 69.6,0.05 0,0.05
  pour Bottom: 0.1,70.87 83.41,70.87 83.41,33.66 54.89,33.66 54.18,32.94 54.18,15.39 55.27,14.3 63.47,14.3 69.6,8.18 69.6,0.05 0,0.05 0,70.87
+5V  (via drill 0.35)
  Top 0.152: V_SSR.3 8.28,29.34 6.58,29.34 6.32,29.59 6.32,36.32 6.96,36.96 11.14,36.96
  Top 0.406: v6.07,60.33 6.6,60.85 D6.C 15.76,60.85 16.97,59.64 22.3,59.64 24.28,57.66 29.31,57.66 30.56,58.9 U6.5V | EXP.1 19.35,5.44 16.69,5.44 9.36,12.77 9.36,23.67 8.18,24.85 5.62,24.85 3.73,26.73 3.73,34.58 6.11,36.96 | 6.11,36.96 11.14,36.96 | v0.61,47.5 1.07,47.5 4.01,44.55 4.01,37.39 4.44,36.96 6.11,36.96
  Top 0.61: C13.+ 14.35,43.92 12.4,41.96 U2.1
  Top 0.711: U2.1 12.4,38.71 12.04,38.35 C12.1 11.14,36.96 11.14,35.45 15.72,30.86 16.75,30.86 BZ.P 23.44,30.98 PS1.4
  Bottom 0.406: v0.61,47.5 0.61,59.82 1.12,60.33 v6.07,60.33
BZR
  Top 0.152: U8.3 54.58,50.55 56.85,48.28 63.5,48.28 65.02,46.76 65.02,36.04 63.68,34.7 54.41,34.7 53.14,33.42 53.14,14.94 54.81,13.26 57.35,13.26 58.72,11.89 58.72,10.36 57.46,9.09 36.73,9.09 35.21,7.57 17.52,7.57 11.46,13.64 11.46,28.32 12.55,29.41 23.34,29.41 26.77,32.84 26.77,35.15 26.57,35.36 25.35,35.36 23.16,33.17 18.29,33.17 16.42,35.04 Q3.1 16.42,38.25 R10.1
ENC_BTN  (via drill 0.3)
  Top 0.152: ENC.3 23.24,61.82 37.8,61.82 40.13,59.49 40.13,58.57 39.12,57.56 v39.01,57.56 | v38.79,54.8 38.84,54.76 38.84,53.34 40.45,51.73 | 40.45,51.73 | 40.45,51.73 40.51,51.67 40.82,51.67 U1.36
  Bottom 0.152: v39.01,57.56 38.54,57.08 38.54,55.06 v38.79,54.8
ENC_CLK/A  (via drill 0.3)
  Top 0.152: U1.8 36.55,46.93 37.04,47.42 v37.39,47.42 | v28.6,46.58 28.28,46.27 17.2,46.27 14.96,48.51 6.71,48.51 5.72,47.52 1.65,47.52 1.07,48.1 0.76,48.1 0.48,48.39 0.48,60.71 2.64,62.87 10.26,62.87 13.64,66.25 ENC.5
  Bottom 0.152: v37.39,47.42 37.01,47.04 29.72,47.04 29.26,46.58 v28.6,46.58
ENC_DT/B  (via drill 0.3)
  Top 0.152: U1.5 36.3,48.28 v36.3,48.46 | v26.87,46.99 26.52,46.99 26.26,46.74 17.17,46.74 15.09,48.82 6.58,48.82 5.59,47.83 1.78,47.83 1.2,48.41 0.89,48.41 0.79,48.51 0.79,60.58 2.77,62.56 11.17,62.56 15.03,66.42 ENC.4
  Bottom 0.152: v26.87,46.99 27.33,46.99 28.19,47.86 34.78,47.86 35.39,48.46 v36.3,48.46
GND  (via drill 0.3, 0.35, 0.4)
  Top 0.152: C23.2 51.84,46.43 v51.93,46.34 | C18.2 70.21,41.78 | C19.2 70.09,48.11 v71.02,48.11
  Top 0.2: v39.96,46.87 | v39.96,46.87 U1.19
  Top 0.356: C17.2 v25.74,54.11 v25.76,54.1 | USB_BOOT.2 12.27,51.94 v11.5,51.94 | USB.5 6.35,52.42 v6.71,52.07 | C13.- 15.19,40.77 v13.56,40.77 | R10.2 v13.31,38.48 | C14.- 6.45,40.64 | U2.2 9.37,41.27 | C12.2 v8.43,38.35 | R8.2 10.48,31.84 v10.52,31.88 | R6.2 10.02,34.87 v10.46,34.87 | U7.7 v24.49,41.15 | U7.4 21.81,44.96 v21.06,44.96
  Top 0.406: C10.2 v30.63,45.64 | C11.2 v33.5,42.8 | C20.2 27.76,41.11 v27.76,41.96 | v13.89,39.62 14.05,39.62 C13.- 15.29,40.87 v15.29,39.46 | C2.2 30.22,52.89 v29.62,53.49 | C7.2 30.73,54.66 v30.73,54.63 | C6.2 32.03,55.5 v31.62,55.5 | C1.2 33.35,57.07 v33.2,57.07 | C4.2 34.92,57.57 v34.29,58.19 | v41.83,58.27 41.18,57.62 C5.2 | C8.2 v42.93,57.17 | C21.2 43.67,41.75 v43.67,41.07 | C3.2 46.13,43.61 v46.18,43.61 | C24.2 45.47,43.18 v45.59,43.05 | C22.2 42.35,41.01 v42.98,40.39
  Top 0.61: C16.2 53.35,42.48 | 53.35,42.48 v53.31,42.44 | RST.2 53.35,41.54 53.35,42.48 | v4.9,40.45 6.26,40.45 6.45,40.64 | v6.45,39.37 6.45,40.64 | 6.45,40.64 7.81,40.64 v8,40.45 8.57,39.88 C15.2 | v8.48,41.27 8.51,41.3 U2.2 | U5.1 69.21,35.71 v69.49,35.71 70.13,36.35 JP2.1 | Q2.2 9.21,32 R8.2 | v57.51,46.08 58.41,46.08 R15.2 58.33,46 Q6.2 | U8.13 46.43,51.82 v45.59,52.65 45.59,53.16 C9.2 | JP1.1 70.13,41.86 70.18,41.81 | 70.18,41.81 70.21,41.78 | v71.02,41.81 70.18,41.81 | v26.54,45.47 26.13,45.47 U7.1 U7.2 U7.3 U7.4 | ST.C PWR.C 18.39,36.96 v18.26,37.08 | R10.2 14.49,36.77 Q3.2 | Q1.2 7.55,35.52 R6.2 | v21.31,49.35 U3.4 | U8.8 v52.3,56.9
  Top 0.65: U4.1 69.88,43.05 JP1.1
  other vias: 18.69,49.27 23.11,47.62 14.48,47.49 50.39,50.85 48.06,46.89 41.58,39.72 23.98,34.95 27.33,35.76 0.61,46.43 5.69,61.26 19.56,44.91 9.55,59.99 49.58,61.42 41.99,45.01 66.22,43.43 71.93,50.85 63.55,57.1 38,57.56 37.54,55.5 50.42,40.87 34.65,33.49 37.08,33.49 34.65,31.05 37.08,31.05 34.65,28 37.08,28 34.65,25.57 37.08,25.57 34.65,22.52 37.08,22.52 34.65,20.08 37.08,20.08 34.65,17.03 37.08,17.03 34.65,14.59 37.08,14.59 32.41,31.05 32.41,28 32.41,25.57 32.41,22.52 32.41,20.08 32.41,17.03 32.41,14.59 25.3,24.96 27.74,24.96 25.3,22.52 27.74,22.52 25.3,19.47 27.74,19.47 25.3,17.03 27.74,17.03 27.74,27.39 39.42,31.05 39.42,28 39.42,25.57 39.42,22.52 39.42,20.08 39.42,17.03 39.42,14.59 41.96,31.05 41.96,28 41.96,25.57 41.96,22.52 41.96,20.08 41.96,17.03 41.96,14.59 44.5,28 44.5,25.57 44.5,22.52 44.5,20.08 44.5,17.03 44.5,14.59 47.04,28 47.04,25.57 47.04,22.52 47.04,20.08 47.04,17.03 47.04,14.59 49.58,31.15 49.58,25.57 49.58,22.52 49.58,20.08 49.58,17.03 49.58,14.59 51.82,31.15 51.82,28 51.82,25.57 51.82,22.52 51.82,20.08 51.82,17.03 51.82,14.59 47.04,34.2 49.58,34.2 51.82,34.2 44.6,34.2 44.6,36.64 41.55,36.64 65.53,49.48 34.65,36.72 36.47,49.83 13.41,24.96 15.85,24.96 13.41,22.52 13.41,19.47 15.85,19.47 13.41,17.03 15.85,17.03 17.68,27.39 15.85,27.39 13.41,27.39 17.68,24.96 20.12,24.96 20.12,22.52 17.68,19.47 20.12,19.47 17.68,17.03 20.12,17.03 17.68,14.59 20.12,14.59 15.85,14.59 13.41,14.59 32.41,33.49 32.41,36.72 63.68,43.43 66.6,39.98 63.75,42.04 66.9,49.17 1.19,40.76 1.19,41.77 1.19,42.79 1.19,43.8 1.19,39.74 1.19,38.72 2.21,43.8 2.21,42.79 3.23,42.79 3.23,43.8 3.23,41.77 2.21,41.77 2.21,40.76 3.23,40.76 2.21,39.74 3.23,39.74 2.21,38.72 3.23,38.72 72.24,45.31 75.29,48.51 75.29,52.63 71.63,57.2 71.63,55.22 71.63,53.54 17.53,60.71 19.35,60.71 20.88,60.71 16.15,64.67 15.09,63.6 14.02,62.69 21.79,53.24 25.76,49.89 14.94,52.02 17.53,43.33 19.2,43.38 21.49,42.88 20.73,38.76 30.28,25.57 30.28,22.52 30.28,20.08
  pour Route2: 0,70.87 83.41,70.87 83.41,33.66 54.89,33.66 54.18,32.94 54.18,15.39 55.27,14.3 63.47,14.3 69.6,8.18 69.6,0.05 0,0.05
  pour Route15: 0,70.87 83.41,70.87 83.41,33.66 54.89,33.66 54.18,32.94 54.18,15.39 55.27,14.3 63.47,14.3 69.6,8.18 69.6,0.05 0,0.05
I2C0_SCL  (via drill 0.3)
  Top 0.152: 29.77,44.53 28.93,44.53 26.52,42.11 24.38,42.11 23.22,40.95 U7.6 23.22,38.71 22.45,37.95 19.3,37.95 18.52,38.73 R5.2 | 29.77,44.53 31.11,44.53 33.58,46.99 33.88,46.99 U1.3 | 29.77,44.53 29.16,43.92 v29.16,38.01 | v28.78,33.27 27.87,32.36 27.58,32.36 23.72,28.5 22.72,28.5 18.34,24.11 18.34,22 16.81,20.47 16.81,13 17.58,12.24 17.58,9.8 v17.12,9.35
  Bottom 0.152: v29.16,38.01 29.16,33.65 v28.78,33.27 | v17.12,9.35 16.18,8.41 EXP.3
I2C0_SDA  (via drill 0.3)
  Top 0.152: U1.2 34.23,47.9 33.98,47.9 31.03,44.96 28.14,44.96 26.01,42.82 23.06,42.82 22.86,42.62 | 22.86,42.62 21.95,41.71 U7.5 21.52,39.92 R4.2 | 22.86,42.62 23.01,42.62 v23.37,42.27 | v28.24,42.88 28.7,42.42 28.7,38.46 v28.24,38 | v27.79,31.75 24.14,28.09 22.91,28.09 20.78,25.96 20.78,12.85 19.94,12.01 19.94,10.73 19.1,9.9 v19.1,8.58
  Bottom 0.152: v23.37,42.27 23.98,42.88 v28.24,42.88 | v28.24,38 28.55,37.69 28.55,33.87 28.2,33.52 28.2,32.15 v27.79,31.75 | v19.1,8.58 19.1,4.02 EXP.2
LCD_CS
  Top 0.152: RN4.5 45.69,57.99 48.4,57.99 49.84,59.44 U6.LCD_CS
LCD_D0
  Top 0.152: RN1.2 35.94,41.77 35.94,12.47 34.65,11.18 U6.LCD_D0
LCD_D1
  Top 0.152: U6.LCD_D1 33.58,13.18 33.58,34.34 35.53,36.3 35.53,41.07 35.37,41.24 RN1.1
LCD_D2
  Top 0.152: RN2.4 39.64,40.4 38.43,39.19 38.43,37.82 41.86,34.39 43.48,34.39 50.88,27 U6.LCD_D2
LCD_D3
  Top 0.152: U6.LCD_D3 48.34,28.75 43.25,33.83 41.63,33.83 38,37.46 38,39.32 39.09,40.41 RN2.3
LCD_D4
  Top 0.152: U6.LCD_D4 45.8,30.35 42.88,33.27 41.4,33.27 37.59,37.08 37.59,39.98 38.59,40.97 RN2.2
LCD_D5
  Top 0.152: U6.LCD_D5 43.26,32.03 42.57,32.72 41.16,32.72 37.19,36.69 37.19,40.94 RN2.1
LCD_D6
  Top 0.152: U6.LCD_D6 40.72,32.37 36.78,36.31 36.78,41.2 36.97,41.39 RN1.4
LCD_D7
  Top 0.152: U6.LCD_D7 38.18,34.12 36.37,35.93 36.37,41.4 36.42,41.45 RN1.3
LCD_RD
  Top 0.152: U6.LCD_RD 43.88,58.81 RN4.8
LCD_RS
  Top 0.152: RN4.6 44.93,58.14 45.08,58.29 47.19,58.29 U6.LCD_RS
LCD_RST
  Top 0.152: U6.LCD_RST 52.27,58.29 49.13,58.29 48.52,57.68 46.48,57.68 45.95,57.15 45.95,56.47 45.77,56.3 45.6,56.3 44.99,55.69 44.86,55.69 44.51,55.35 43.93,55.35 U1.37
LCD_WR
  Top 0.152: RN4.7 44.43,58.6 45.26,59.44 U6.LCD_WR
LO0
  Top 0.152: U8.7 55.32,55.63 R11.1
LO0-
  Top 0.61: LO0.2 54.86,63.88 56.36,63.88 57.89,62.35 D3.A 59.67,59.18 65.51,59.18 66.4,60.07 66.4,62.23 67.41,63.25 68.85,63.25 Q4.3
LO1
  Top 0.152: U8.6 55.7,54.36 R13.1
LO1-
  Top 0.61: LO1.2 63.99,64.27 | 63.99,64.27 64.24,64.02 D2.A | Q5.3 66.07,64.27 63.99,64.27
N$1
  Top 1.016: F1.1 80.75,27.3 AC.1
N$2
  Top 1.016: F1.2 59.88,27.81 PS1.2
N$3
  Top 1.016: AC.2 71.68,21.26 PS1.1
N$4
  Top 0.152: R1.1 PWR.A
N$5  (via drill 0.3)
  Top 0.152: BZ.N 17.17,23.38 22.6,28.8 23.6,28.8 27.38,32.59 27.38,33.87 v27.66,34.15 | v25.65,34.65 25.07,34.65 23.29,32.87 17.23,32.87 Q3.3
  Bottom 0.152: v27.66,34.15 27.16,34.65 v25.65,34.65
N$6
  Top 0.152: USB.3 6.58,53.72 6.96,53.34 7.51,53.34 R3.2
N$7
  Top 0.152: USB.2 6.47,54.37 7.09,54.99 R2.2
N$8
  Top 0.152: R11.2 59.33,57.94 OC1.1
N$9  (via drill 0.3)
  Top 0.152: OC1.4 62.43,57.94 v62.08,58.29 | v54.33,62.64 54.33,61.73 R12.2
  Bottom 0.152: v62.08,58.29 57.73,62.64 v54.33,62.64
N$10
  Top 0.152: OC1.3 69.71,57.05 69.75,57.05 72.35,59.65 Q4.1
N$11
  Top 0.152: OC2.1 59.56,52.45 R13.2
N$12  (via drill 0.3)
  Top 0.152: R14.2 50.81,62.27 v51.18,62.64 | v62.11,57.43 67.1,52.45 OC2.4
  Bottom 0.152: v62.11,57.43 61.33,58.22 61.33,58.31 57.86,61.77 54.09,61.77 53.23,62.64 v51.18,62.64
N$13
  Top 0.152: Q5.1 72.68,67.5 73.25,66.93 73.25,62.1 72.65,61.5 72.65,59.52 70.59,57.46 70.59,50.55 69.82,49.78 68.19,49.78 OC2.3
N$14
  Top 0.152: U5.6 59.11,39.17 58.43,39.84 58.43,40.39 | 58.43,40.39 R16.2 | Q6.3 59.28,41.24 58.43,40.39
N$15
  Top 0.152: U1.13 37.57,45.02 37.57,44.25 36.42,43.1 RN1.6
N$16
  Top 0.152: USB_BOOT.1 14.55,53.42 R20.2
N$17
  Top 0.152: RN1.7 35.92,43.06 37.19,44.32 37.19,45.21 U1.12
N$18
  Top 0.152: ST.A 22.85,35.67 25.8,35.67 27.09,36.96 R18.2
N$19
  Top 0.152: U1.11 37.4,45.88 36.88,45.37 36.88,44.65 35.37,43.14 RN1.8
N$20
  Top 0.152: RN1.5 38.07,43.9 38.07,44.96 U1.14
N$21
  Top 0.152: RN2.8 38.04,43.17 39.43,44.56 U1.15
N$22
  Top 0.152: RN2.7 38.59,43.16 40.01,44.58 40.01,45.12 U1.16
N$23
  Top 0.152: RN2.6 39.09,43.23 40.44,44.58 40.44,45.26 U1.17
N$24
  Top 0.406: USB.1 6.1,55.02 6.58,55.5 6.58,56.01 7.32,56.75 D6.A
N$25
  Top 0.152: RN2.5 39.64,43.34 39.83,43.54 39.93,43.64 40.74,44.45 40.74,45.52 U1.18
N$26
  Top 0.152: U1.4 34.95,47.5 34.95,47.3 32.82,45.16 32.23,45.16 30.16,43.09 RN3.8
N$27
  Top 0.152: RN3.7 30.71,43.08 32.33,44.7 32.97,44.7 35.1,46.84 35.42,46.84 U1.6
N$28
  Top 0.152: U1.7 35.53,46.38 35.26,46.38 33.12,44.25 32.45,44.25 31.21,43.01 RN3.6
N$29
  Top 0.152: U1.9 36.51,46.23 36.3,46.23 35.76,45.7 35.31,45.7 33.41,43.79 32.61,43.79 31.76,42.94 RN3.5
N$30
  Top 0.152: U1.38 41.38,53.37 41.5,53.37 43.78,55.65 44.39,55.65 44.73,55.99 44.87,55.99 45.48,56.6 RN4.4
N$31
  Top 0.152: U1.39 41.12,53.67 41.37,53.67 43.66,55.96 44.26,55.96 44.6,56.3 44.67,56.3 44.93,56.55 RN4.3
N$32
  Top 0.152: U1.40 40.86,53.98 41.24,53.98 43.53,56.26 44.14,56.26 44.43,56.55 RN4.2
N$33
  Top 0.152: U1.41 40.6,54.28 41.12,54.28 43.61,56.78 RN4.1
N$34
  Top 0.65: U5.2 69.95,37.9 JP2.2 77.44,37.72 79.35,35.81 TC.4
N$35
  Top 0.65: U4.2 69.93,44.32 JP1.2 72.62,44.12 76.86,48.36 76.86,49.89 78.03,51.05 TC.2
QSPI_CSN
  Top 0.152: U3.1 18.45,53.16 R20.1 R21.1 18.83,51.26 22.15,51.26 25.35,48.06 31.8,48.06 32.31,48.56 32.89,48.56 34.32,49.99 U1.56
QSPI_SCK
  Top 0.152: U1.52 35.26,51.56 33.55,51.56 32.03,50.04 29.16,50.04 28.57,50.62 U3.6
QSPI_SD0
  Top 0.152: U1.53 35.04,51.22 34.1,51.22 32.46,49.58 31.22,49.58 30.99,49.35 U3.5
QSPI_SD1
  Top 0.152: U1.55 34.55,50.58 34.2,50.58 32.59,48.97 31.45,48.97 31.14,48.67 25.65,48.67 22.43,51.89 U3.2
QSPI_SD2  (via drill 0.3)
  Top 0.152: U1.54 35.62,50.08 v35.62,49.73 | v24.13,47.6 24.13,48.21 21.72,50.62 U3.3
  Bottom 0.152: v35.62,49.73 35.25,49.73 34.72,49.2 26.03,49.2 24.43,47.6 v24.13,47.6
QSPI_SD3
  Top 0.152: U1.51 35.4,51.99 33.51,51.99 32.84,51.33 32.34,51.33 31.69,50.67 29.9,50.67 28.68,51.89 U3.7
RST
  Top 0.152: U1.26 43.15,47.64 44.66,47.64 47.94,44.37 48.94,44.37 49.72,43.59 49.89,43.59 | 50.05,43.48 R19.2 | C16.1 R19.2 | 49.89,43.59 R19.2 | RST.1 49.89,43.13 49.89,43.59
SFT_DATA
  Top 0.152: 47.6,50.55 U8.14 45.26,50.55 44.68,51.13 44.54,51.13 44.27,51.41 44.09,51.41 44.04,51.36 43.84,51.36 43.64,51.56 42.98,51.56 U1.32
SFT_LATCH
  Top 0.152: U8.12 46.85,53.09 45.38,54.56 45.04,54.56 45.04,54.54 43.26,52.75 42.72,52.75 42.09,52.12 42.09,51.81 U1.34
SFT_SCK
  Top 0.152: U8.11 47.57,54.38 46.91,55.04 44.46,55.04 41.74,52.32 41.74,52.03 U1.35
SPI0_CS
  Top 0.152: U6.SD_SS 29.03,10.29 28.24,9.5 25.96,9.5 25.2,10.26 25.2,12.58 28.85,16.23 28.85,27.94 31.21,30.3 RN3.3
SPI0_RX
  Top 0.152: U6.SD_DO 23.95,25.48 30.72,32.25 30.72,35.71 30.71,35.72 RN3.2
SPI0_SCK
  Top 0.152: U6.SD_SCK 21.41,24.31 30.16,33.06 RN3.1
SPI0_TX
  Top 0.152: U6.SD_DI 26.49,13.08 31.77,18.36 31.77,40.44 31.76,40.45 RN3.4
SSR0
  Top 0.152: U8.4 54.84,51.82 55.98,50.67 55.98,49.58 56.97,48.59 63.63,48.59 65.33,46.89 65.33,35.92 63.8,34.39 54.53,34.39 53.44,33.3 53.44,15.06 54.94,13.56 57.48,13.56 59.03,12.02 59.03,10.23 57.58,8.79 36.86,8.79 35.33,7.26 17.4,7.26 11.15,13.51 11.15,32.89 10.22,33.82 R6.1 9.34,33.78 Q1.1
SSR0+
  Top 0.152: R7.2 4.17,27.85 4.17,33.64 Q1.3
  Top 0.2: R7.2 5.09,26.15 5.94,25.3 8.49,25.3 9.81,23.98 9.81,12.96 16.87,5.9 35.3,5.9 35.33,5.93 35.89,5.93 37.41,7.44 38.54,7.44 39.37,6.61 39.37,3.77 39.83,3.31 39.83,3.3 41.3,1.83 59.51,1.83 SSR.2
SSR1
  Top 0.152: Q2.1 9.34,30.1 R8.1 9.92,30.14 10.85,29.21 10.85,13.39 17.27,6.96 35.46,6.96 36.98,8.48 57.71,8.48 59.33,10.11 59.33,12.14 57.61,13.87 55.07,13.87 53.75,15.19 53.75,33.17 54.66,34.09 63.93,34.09 65.63,35.79 65.63,47.01 63.75,48.9 57.1,48.9 56.29,49.71 56.29,50.8 55.35,51.74 55.35,52.58 54.84,53.09 U8.5
SSR1+
  Top 0.152: R9.2 5.09,30.88 Q2.3
  Top 0.2: SSR.4 49.7,2.18 41.45,2.18 39.73,3.91 39.73,6.76 38.68,7.8 37.26,7.8 35.74,6.28 35.18,6.28 35.15,6.25 17.02,6.25 10.16,13.1 10.16,24.12 8.64,25.65 6.6,25.65 5.99,26.26 5.99,28.3 5.84,28.45 R9.2
ST_LED
  Top 0.152: U8.2 54.58,49.28 55.88,47.98 60.25,47.98 60.35,47.88 63.47,47.88 64.72,46.63 64.72,36.17 63.55,35 54.28,35 52.83,33.55 52.83,14.81 54.69,12.95 57.23,12.95 58.42,11.76 58.42,10.49 57.33,9.4 36.6,9.4 35.08,7.87 17.65,7.87 11.76,13.77 11.76,28.19 12.67,29.11 23.47,29.11 27.08,32.72 27.08,34.54 29.15,36.61 R18.1
SWCLK
  Top 0.152: DBG.5 47.29,37.24 45.42,37.24 44.3,38.35 44.3,41.25 45.47,42.42 45.92,42.42 46.83,43.32 46.83,44.26 44.3,46.79 42.97,46.79 42.07,47.68 U1.24
SWD
  Top 0.152: DBG.4 49.96,37.57 48.56,38.96 46.02,38.96 44.7,40.28 44.7,41.2 45.62,42.11 46.05,42.11 47.14,43.21 47.14,44.37 44.42,47.09 43.13,47.09 U1.25
TC+0
  Top 0.65: U4.3 70.84,45.59 74.07,48.82 74.07,54.71 78.03,58.67 TC.1
TC+1
  Top 0.65: U5.3 77.37,39.17 81,42.8 TC.3
TC_CS  (via drill 0.3)
  Top 0.152: U4.6 60.64,45.59 60.28,45.95 | 60.28,45.95 R15.1 58.86,47.37 55.47,47.37 54.71,46.61 52.98,46.61 50.32,49.28 v49.12,49.28 | Q6.1 60.23,45.91 60.28,45.95 | U1.30 43.19,50.65 43.64,50.65 44.55,49.74 45.15,49.74 45.62,49.28 v46.05,49.28
  Bottom 0.152: v46.05,49.28 v49.12,49.28
TC_DO  (via drill 0.3)
  Top 0.152: U1.29 43.66,49.44 45.03,49.44 45.9,48.56 50.6,48.56 52.86,46.3 54.89,46.3 57.7,43.5 | 57.7,43.5 57.76,43.43 60.68,43.43 61.57,44.32 U4.7 v63.68,44.32 | TSENS.2 33.92,66.42 37.63,70.13 72.8,70.13 73.56,69.37 73.56,60 72.62,59.06 72.62,52.96 v71.22,51.56 | v69.57,51.18 66.9,51.18 66.22,50.49 v66.22,44.32 | U5.7 61.44,38.61 58.97,38.61 57.7,39.88 57.7,43.5
  Bottom 0.152: v71.22,51.56 70.84,51.18 v69.57,51.18 | v66.22,44.32 v63.68,44.32
TC_SCK
  Top 0.152: U5.5 64.16,40.44 64.41,40.69 64.41,46.51 64.06,46.86 U4.5 60.93,46.86 60.12,47.68 55.35,47.68 54.59,46.91 53.11,46.91 50.04,49.99 45.36,49.99 44.52,50.83 43.94,50.83 43.66,51.1 43.08,51.1 U1.31
UART0_RX
  Top 0.152: DBG.2 56.29,38.61 56.29,43.64 54.26,45.66 48.15,45.66 45,48.81 U1.28
UART0_TX
  Top 0.152: DBG.3 54.2,39.06 54.76,39.06 55.83,40.13 55.83,43.45 54.07,45.2 47.96,45.2 44.96,48.21 43.14,48.21 U1.27
USB_D_N
  Top 0.152: R2.1 10.64,54.99 11.63,55.98 23.98,55.98 24.74,56.74 | 24.74,56.74 | 24.74,56.74 24.83,56.83 32.37,56.83 32.46,56.74 | 32.46,56.74 | 32.46,56.74 35.2,54 35.84,54 36.12,53.72 36.5,53.72 | U1.46 36.5,53.72 | 36.5,53.72
USB_D_P
  Top 0.152: R3.1 10.19,53.47 11.39,54.67 11.39,55.31 11.76,55.68 24.1,55.68 24.96,56.53 32.24,56.53 35.08,53.7 35.71,53.7 35.99,53.41 36.24,53.41 U1.47 | U1.47
V_SSR
  Top 0.152: R9.1 6.79,27.56 | 6.79,27.56 R7.1 | V_SSR.2 6.79,27.56
V_SSR_EXT
  Top 0.2: V_SSR.1 9.25,25.76 10.52,24.48 10.52,13.25 17.14,6.63 35.59,6.63 37.11,8.15 41.08,8.15 42.16,7.07 VSSR_EXT.2
VLO+  (via drill 0.4)
  Top 0.254: R12.1 55.94,62.27 54.94,63.27 53.19,63.27 | R14.1 52.51,62.6 53.19,63.27 | 53.19,63.27 48.44,63.27 LCOM.1
  Top 0.61: LCOM.1 47.33,68.45 53.19,68.45 | LO0.1 54.82,66.82 53.19,68.45 | 53.19,68.45 59.64,68.45 | 59.64,68.45 63.09,68.45 64.34,67.2 LO1.1 | D3.C 61.94,62.26 61.26,62.94 | 61.26,62.94 59.64,64.57 59.64,68.45 | D2.C 70.05,60.96 v70.1,60.91 | v62.89,62.94 61.26,62.94
  Bottom 0.61: v70.1,60.91 64.92,60.91 v62.89,62.94
VLO-
  Top 0.61: LCOM.2 45.97,69.6 71.32,69.6 | Q5.2 72.16,69.6 71.32,69.6 | Q4.2 71.32,66.62 71.32,69.6
XIN
  Top 0.152: U1.20 41.14,46.25 41.14,45.94 41.05,45.84 41.05,44.32 40.6,43.88 40.6,42.66 C22.1 40.3,42.25 40.28,42.27 34.95,42.27 34.42,41.73 Y1.2
XOUT
  Top 0.152: Y1.1 39.85,38.28 40.64,39.06 40.64,40.59 42.27,42.21 42.27,43.16 C21.1 41.35,44.07 41.35,45.71 41.45,45.81 41.45,46.51 U1.21